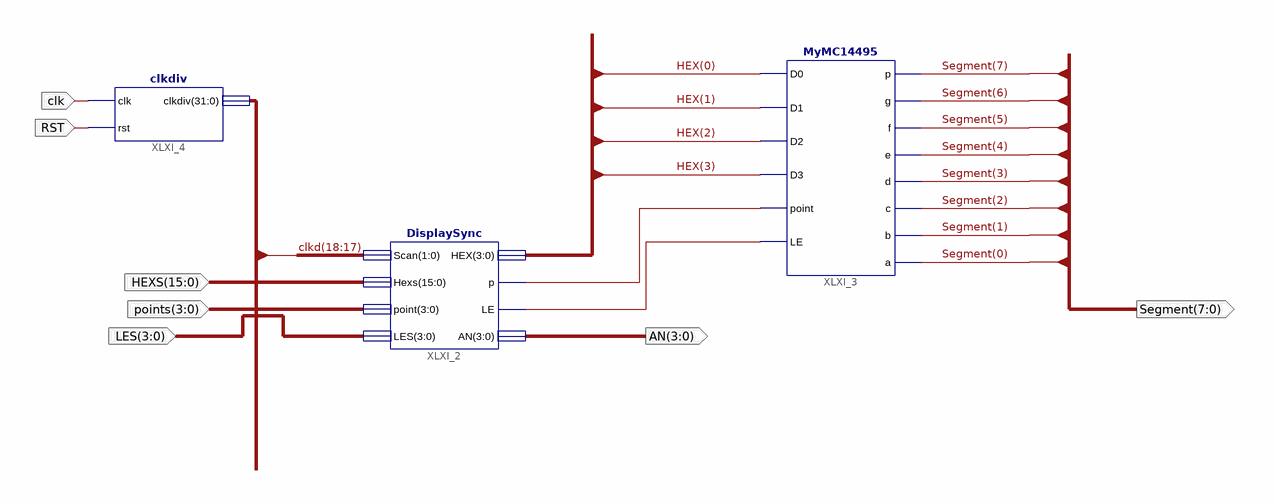
[diagram p0: schematic sheet 1]
// Xilinx ISE schematic DispNum.sch (kintex7) as structural Verilog: 3 symbols, 7 ports
module DispNum (
  input  clk,
  input  RST,
  input  [15:0] HEXS,
  input  [3:0] points,
  input  [3:0] LES,
  output [3:0] AN,
  output [7:0] Segment
);

  wire XLXN_23, XLXN_24;
  wire [3:0] HEX;
  wire [31:0] clkd;

  DisplaySync XLXI_2 (
    .Scan(clkd[18:17]), .Hexs(HEXS), .point(points), .LES(LES), .HEX(HEX), .p(XLXN_23), .LE(XLXN_24), .AN(AN));
  MyMC14495 XLXI_3 (
    .D0(HEX[0]), .D1(HEX[1]), .D2(HEX[2]), .D3(HEX[3]), .point(XLXN_23), .LE(XLXN_24), .p(Segment[7]),
    .g(Segment[6]), .f(Segment[5]), .e(Segment[4]), .d(Segment[3]), .c(Segment[2]), .b(Segment[1]),
    .a(Segment[0]));
  clkdiv XLXI_4 (.clk(clk), .rst(RST), .clkdiv(clkd));
endmodule
